# EAGLE schematic axiom_beta_plugin_module_TE0714_SDI_v0.4.123d784f (EAGLE 7.7.0)
Assembly variants: Beta

## Sheet 1 of 5
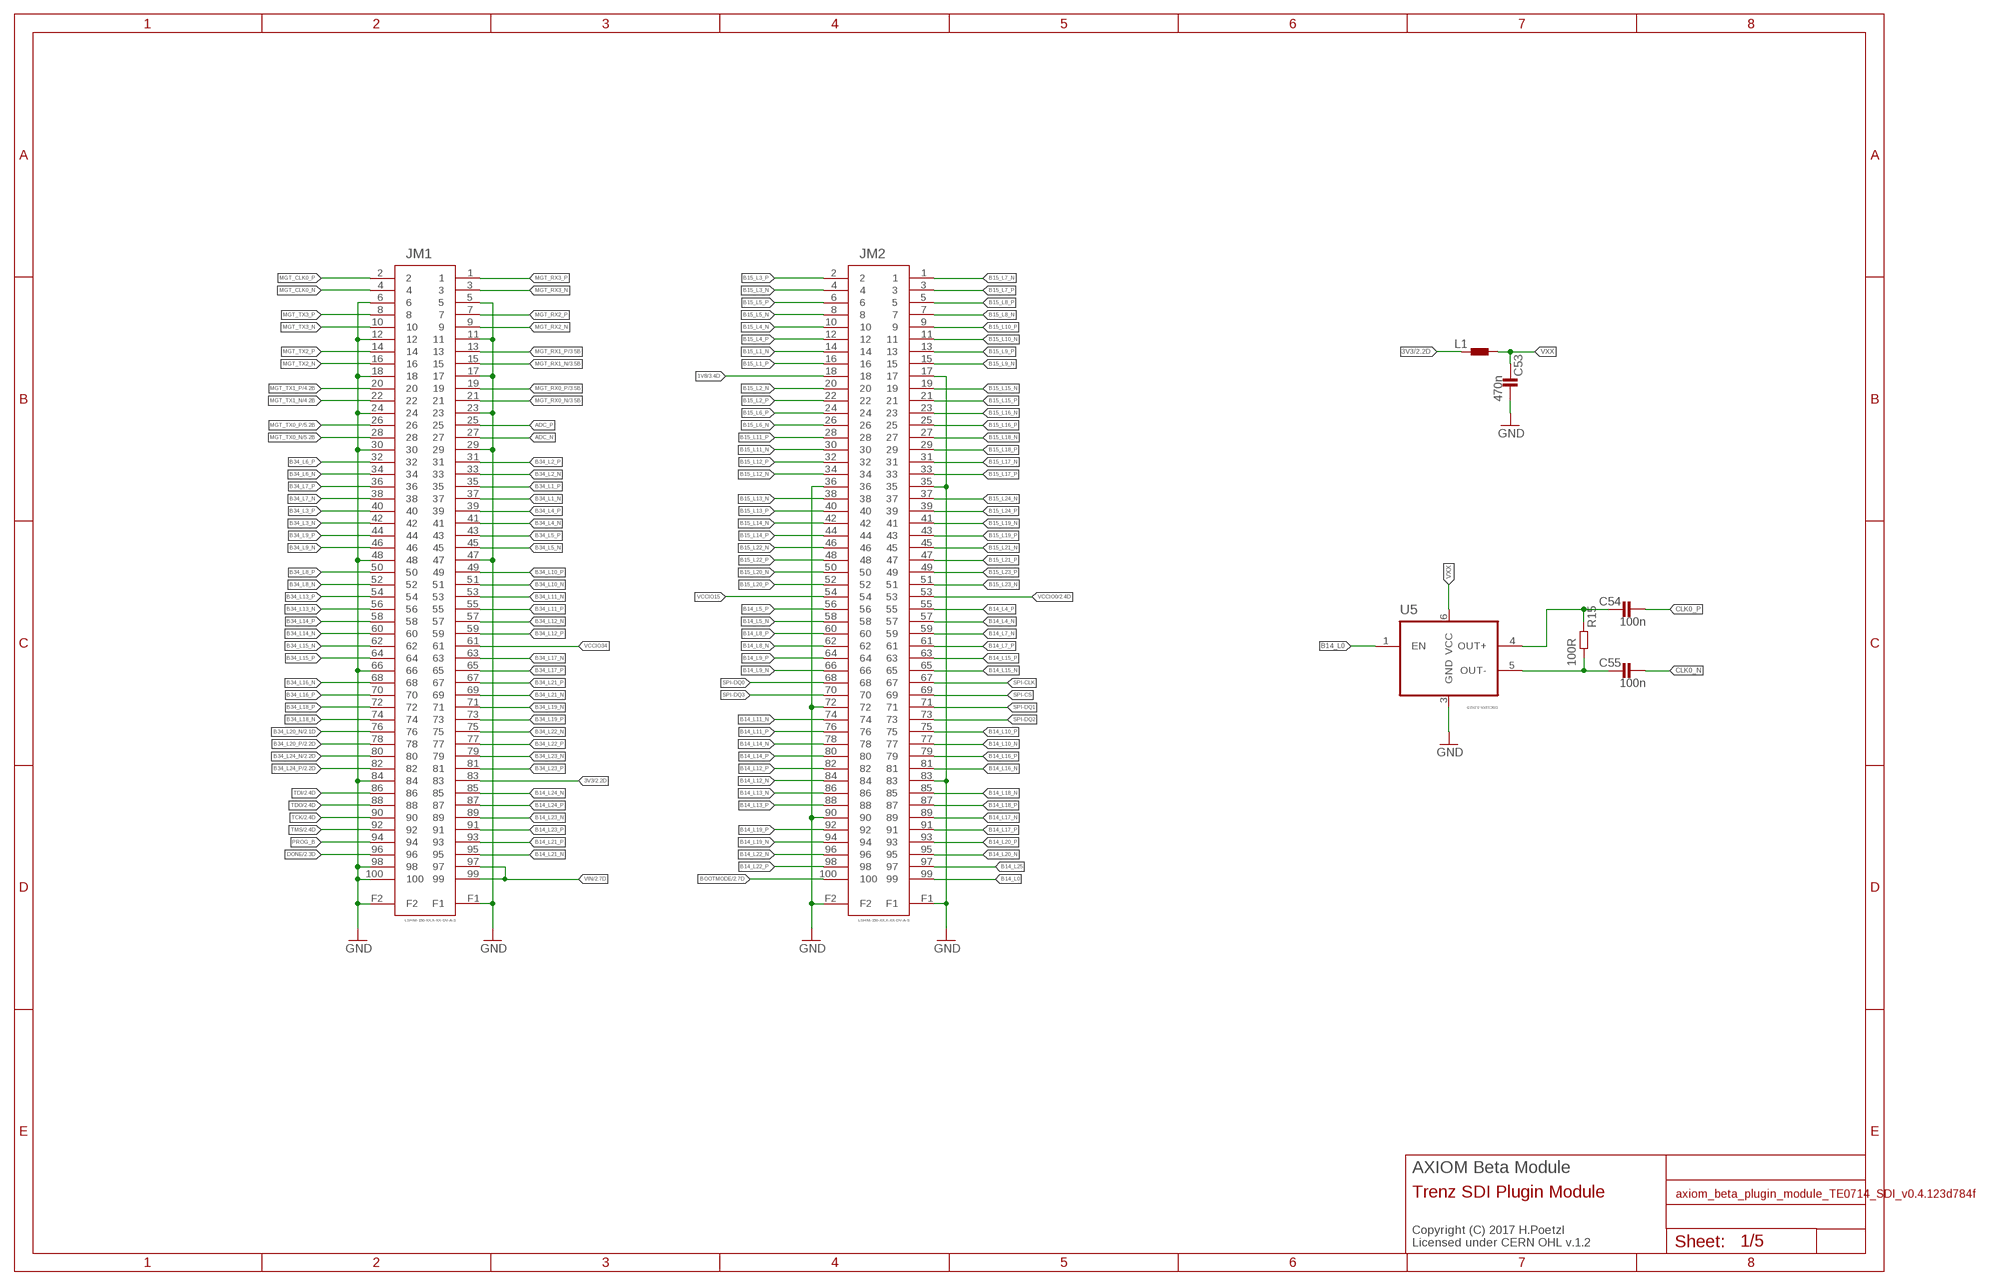
[diagram p0: schematic, sheet 1]

### Parts
C53  470n  C0402-C  [0402-C]
C54  100n  C0201-C  [0201-C]
C55  100n  C0201-C  [0201-C]
JM1  LSHM-150-XX.X-XX-DV-A-S  [LSHM-150-XX.X-XX-DV-A-S]
JM2  LSHM-150-XX.X-XX-DV-A-S  [LSHM-150-XX.X-XX-DV-A-S]
L1  L0402-C  [0402-C]
R15  100R  R0201-C  [0201-C]
U5  DSC11XX-3.2X2.5  [3.2X2.5]

### Nets
1V8 [LVDS]: JM2.18 ; also sheet 3,4,5
3V3 [LVDS]: JM1.83 L1.1 ; also sheet 2,4,5
ADC_N: JM1.27
ADC_P: JM1.25
B14_L0: JM2.99 U5.1(EN)
B14_L4_N: JM2.57
B14_L4_P: JM2.55
B14_L5_N: JM2.58
B14_L5_P: JM2.56
B14_L7_N: JM2.59
B14_L7_P: JM2.61
B14_L8_N: JM2.62
B14_L8_P: JM2.60
B14_L9_N: JM2.66
B14_L9_P: JM2.64
B14_L10_N: JM2.77
B14_L10_P: JM2.75
B14_L11_N: JM2.74
B14_L11_P: JM2.76
B14_L12_N: JM2.84
B14_L12_P: JM2.82
B14_L13_N: JM2.86
B14_L13_P: JM2.88
B14_L14_N: JM2.78
B14_L14_P: JM2.80
B14_L15_N: JM2.65
B14_L15_P: JM2.63
B14_L16_N: JM2.81
B14_L16_P: JM2.79
B14_L17_N: JM2.89
B14_L17_P: JM2.91
B14_L18_N: JM2.85
B14_L18_P: JM2.87
B14_L19_N: JM2.94
B14_L19_P: JM2.92
B14_L20_N: JM2.95
B14_L20_P: JM2.93
B14_L21_N: JM1.95
B14_L21_P: JM1.93
B14_L22_N: JM2.96
B14_L22_P: JM2.98
B14_L23_N: JM1.89
B14_L23_P: JM1.91
B14_L24_N: JM1.85
B14_L24_P: JM1.87
B14_L25: JM2.97
B15_L1_N: JM2.14
B15_L1_P: JM2.16
B15_L2_N: JM2.20
B15_L2_P: JM2.22
B15_L3_N: JM2.4
B15_L3_P: JM2.2
B15_L4_N: JM2.10
B15_L4_P: JM2.12
B15_L5_N: JM2.8
B15_L5_P: JM2.6
B15_L6_N: JM2.26
B15_L6_P: JM2.24
B15_L7_N: JM2.1
B15_L7_P: JM2.3
B15_L8_N: JM2.7
B15_L8_P: JM2.5
B15_L9_N: JM2.15
B15_L9_P: JM2.13
B15_L10_N: JM2.11
B15_L10_P: JM2.9
B15_L11_N: JM2.30
B15_L11_P: JM2.28
B15_L12_N: JM2.34
B15_L12_P: JM2.32
B15_L13_N: JM2.38
B15_L13_P: JM2.40
B15_L14_N: JM2.42
B15_L14_P: JM2.44
B15_L15_N: JM2.19
B15_L15_P: JM2.21
B15_L16_N: JM2.23
B15_L16_P: JM2.25
B15_L17_N: JM2.31
B15_L17_P: JM2.33
B15_L18_N: JM2.27
B15_L18_P: JM2.29
B15_L19_N: JM2.41
B15_L19_P: JM2.43
B15_L20_N: JM2.50
B15_L20_P: JM2.52
B15_L21_N: JM2.45
B15_L21_P: JM2.47
B15_L22_N: JM2.46
B15_L22_P: JM2.48
B15_L23_N: JM2.51
B15_L23_P: JM2.49
B15_L24_N: JM2.37
B15_L24_P: JM2.39
B34_L1_N: JM1.37
B34_L1_P: JM1.35
B34_L2_N: JM1.33
B34_L2_P: JM1.31
B34_L3_N: JM1.42
B34_L3_P: JM1.40
B34_L4_N: JM1.41
B34_L4_P: JM1.39
B34_L5_N: JM1.45
B34_L5_P: JM1.43
B34_L6_N: JM1.34
B34_L6_P: JM1.32
B34_L7_N: JM1.38
B34_L7_P: JM1.36
B34_L8_N: JM1.52
B34_L8_P: JM1.50
B34_L9_N: JM1.46
B34_L9_P: JM1.44
B34_L10_N: JM1.51
B34_L10_P: JM1.49
B34_L11_N: JM1.53
B34_L11_P: JM1.55
B34_L12_N: JM1.57
B34_L12_P: JM1.59
B34_L13_N: JM1.56
B34_L13_P: JM1.54
B34_L14_N: JM1.60
B34_L14_P: JM1.58
B34_L15_N: JM1.62
B34_L15_P: JM1.64
B34_L16_N: JM1.68
B34_L16_P: JM1.70
B34_L17_N: JM1.63
B34_L17_P: JM1.65
B34_L18_N: JM1.74
B34_L18_P: JM1.72
B34_L19_N: JM1.71
B34_L19_P: JM1.73
B34_L20_N: JM1.76 ; also sheet 2
B34_L20_P: JM1.78 ; also sheet 2
B34_L21_N: JM1.69
B34_L21_P: JM1.67
B34_L22_N: JM1.75
B34_L22_P: JM1.77
B34_L23_N: JM1.79
B34_L23_P: JM1.81
B34_L24_N: JM1.80 ; also sheet 2
B34_L24_P: JM1.82 ; also sheet 2
BOOTMODE: JM2.100 ; also sheet 2
CLK0_N: C55.2
CLK0_P: C54.2
DONE: JM1.96 ; also sheet 2
GND: C53.2 JM1.5 JM1.6 JM1.11 JM1.12 JM1.17 JM1.18 JM1.23 JM1.24 JM1.29 JM1.30 JM1.47 JM1.48 JM1.66 JM1.84 JM1.98 JM1.100 JM1.F1 JM1.F2 JM2.17 JM2.35 JM2.36 JM2.72 JM2.83 JM2.90 JM2.F1 JM2.F2 U5.3(GND) ; also sheet 2,3,4,5
MGT_CLK0_N [MGT]: JM1.4
MGT_CLK0_P [MGT]: JM1.2
MGT_RX0_N [MGT]: JM1.21 ; also sheet 3
MGT_RX0_P [MGT]: JM1.19 ; also sheet 3
MGT_RX1_N [MGT]: JM1.15 ; also sheet 3
MGT_RX1_P [MGT]: JM1.13 ; also sheet 3
MGT_RX2_N [MGT]: JM1.9
MGT_RX2_P [MGT]: JM1.7
MGT_RX3_N [MGT]: JM1.3
MGT_RX3_P [MGT]: JM1.1
MGT_TX0_N [MGT]: JM1.28 ; also sheet 5
MGT_TX0_P [MGT]: JM1.26 ; also sheet 5
MGT_TX1_N [MGT]: JM1.22 ; also sheet 4
MGT_TX1_P [MGT]: JM1.20 ; also sheet 4
MGT_TX2_N [MGT]: JM1.16
MGT_TX2_P [MGT]: JM1.14
MGT_TX3_N [MGT]: JM1.10
MGT_TX3_P [MGT]: JM1.8
OUT_N: C55.1 R15.2 U5.5(OUT-)
OUT_P: C54.1 R15.1 U5.4(OUT+)
PROG_B: JM1.94
SPI-CLK: JM2.67
SPI-CS: JM2.69
SPI-DQ0: JM2.68
SPI-DQ1: JM2.71
SPI-DQ2: JM2.73
SPI-DQ3: JM2.70
TCK: JM1.90 ; also sheet 2
TDI: JM1.86 ; also sheet 2
TDO: JM1.88 ; also sheet 2
TMS: JM1.92 ; also sheet 2
VCCIO0 [LVDS]: JM2.53 ; also sheet 2
VCCIO15 [LVDS]: JM2.54
VCCIO34: JM1.61
VIN [LVDS]: JM1.97 JM1.99 ; also sheet 2
VXX: C53.1 L1.2 U5.6(VCC)

### Notes on the sheet
- AXIOM Beta Module
- Trenz SDI Plugin Module
- Copyright (C) 2017 H.Poetzl
  Licensed under CERN OHL v.1.2

## Sheet 2 of 5
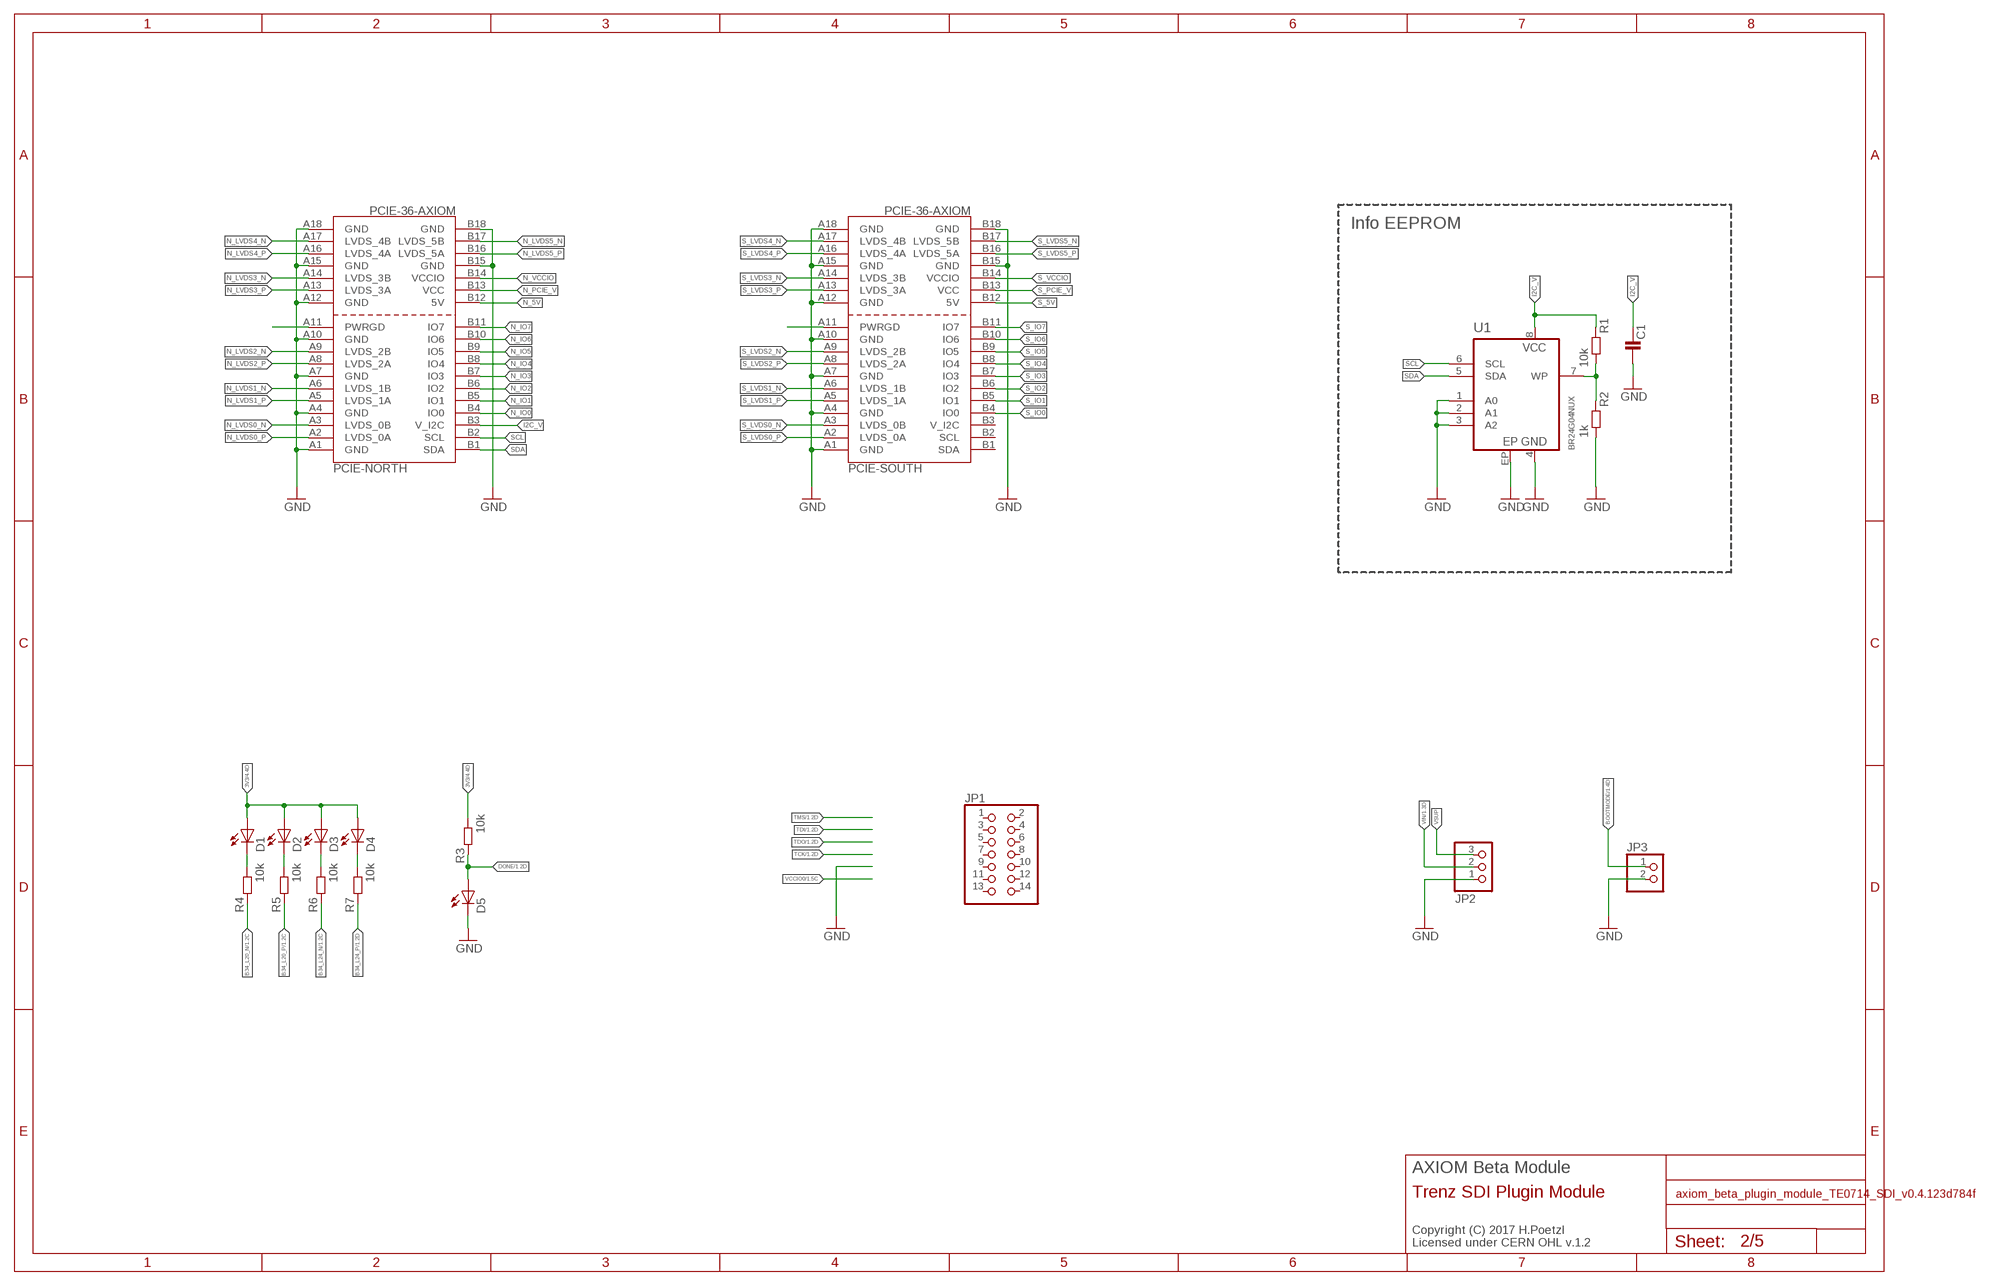
[diagram p1: schematic, sheet 2]

### Parts
C1  C0402-B  [0402-B]
D1  LED  [SMARTLED-TTW]
D2  LED  [SMARTLED-TTW]
D3  LED  [SMARTLED-TTW]
D4  LED  [SMARTLED-TTW]
D5  LED  [SMARTLED-TTW]
JP1  PINHD-2X07_2.00  [2X07M]
JP2  PINHD-1X03_2.54-90°-S  [1X03/90-S]
JP3  PINHD-1X02_2.54-S  [1X02-S]
PCIE-NORTH  PCIE-36-AXIOM  [PCIE-36-AXIOM]  (not fitted in variant Beta)
PCIE-SOUTH  PCIE-36-AXIOM  [PCIE-36-AXIOM]  (not fitted in variant Beta)
R1  10k  R0402-B  [0402-B]
R2  1k  R0402-B  [0402-B]
R3  10k  R0402-C  [0402-C]
R4  10k  R0402-C  [0402-C]
R5  10k  R0402-C  [0402-C]
R6  10k  R0402-C  [0402-C]
R7  10k  R0402-C  [0402-C]
U1  BR24G04NUX  [DFN200X300X100-9N]

### Nets
3V3 [LVDS]: D1.A@1(A) D2.A@1(A) D3.A@1(A) D4.A@1(A) R3.2 ; also sheet 1,4,5
B34_L20_N: R4.1 ; also sheet 1
B34_L20_P: R5.1 ; also sheet 1
B34_L24_N: R6.1 ; also sheet 1
B34_L24_P: R7.1 ; also sheet 1
BOOTMODE: JP3.1 ; also sheet 1
DONE: D5.A@1(A) R3.1 ; also sheet 1
GND: C1.2 D5.C@1(C) JP2.1 JP3.2 PCIE-NORTH.A1(GND) PCIE-NORTH.A4(GND) PCIE-NORTH.A7(GND) PCIE-NORTH.A10(GND) PCIE-NORTH.A12(GND) PCIE-NORTH.A15(GND) PCIE-NORTH.A18(GND) PCIE-NORTH.B15(GND) PCIE-NORTH.B18(GND) PCIE-SOUTH.A1(GND) PCIE-SOUTH.A4(GND) PCIE-SOUTH.A7(GND) PCIE-SOUTH.A10(GND) PCIE-SOUTH.A12(GND) PCIE-SOUTH.A15(GND) PCIE-SOUTH.A18(GND) PCIE-SOUTH.B15(GND) PCIE-SOUTH.B18(GND) R2.2 U1.1(A0) U1.2(A1) U1.3(A2) U1.4(GND) U1.EP ; also sheet 1,3,4,5
I2C_V: C1.1 PCIE-NORTH.B3(V_I2C) R1.1 U1.8(VCC)
N$1 [LVDS]: D1.C@1(C) R4.2
N$2 [LVDS]: D2.C@1(C) R5.2
N$3 [LVDS]: D3.C@1(C) R6.2
N$4 [LVDS]: D4.C@1(C) R7.2
N$209: PCIE-NORTH.A11(PWRGD)
N$216: R1.2 R2.1 U1.7(WP)
N$256: PCIE-SOUTH.A11(PWRGD)
N_5V: PCIE-NORTH.B12(5V)
N_IO0: PCIE-NORTH.B4(IO0)
N_IO1: PCIE-NORTH.B5(IO1)
N_IO2: PCIE-NORTH.B6(IO2)
N_IO3: PCIE-NORTH.B7(IO3)
N_IO4 [LVDS]: PCIE-NORTH.B8(IO4)
N_IO5 [LVDS]: PCIE-NORTH.B9(IO5)
N_IO6: PCIE-NORTH.B10(IO6)
N_IO7: PCIE-NORTH.B11(IO7)
N_LVDS0_N: PCIE-NORTH.A3(LVDS_0B)
N_LVDS0_P: PCIE-NORTH.A2(LVDS_0A)
N_LVDS1_N: PCIE-NORTH.A6(LVDS_1B)
N_LVDS1_P: PCIE-NORTH.A5(LVDS_1A)
N_LVDS2_N: PCIE-NORTH.A9(LVDS_2B)
N_LVDS2_P: PCIE-NORTH.A8(LVDS_2A)
N_LVDS3_N: PCIE-NORTH.A14(LVDS_3B)
N_LVDS3_P: PCIE-NORTH.A13(LVDS_3A)
N_LVDS4_N: PCIE-NORTH.A17(LVDS_4B)
N_LVDS4_P: PCIE-NORTH.A16(LVDS_4A)
N_LVDS5_N: PCIE-NORTH.B17(LVDS_5B)
N_LVDS5_P: PCIE-NORTH.B16(LVDS_5A)
N_PCIE_V: PCIE-NORTH.B13(VCC)
N_VCCIO: PCIE-NORTH.B14(VCCIO)
S_5V: PCIE-SOUTH.B12(5V)
S_IO0: PCIE-SOUTH.B4(IO0)
S_IO1: PCIE-SOUTH.B5(IO1)
S_IO2 [LVDS]: PCIE-SOUTH.B6(IO2)
S_IO3: PCIE-SOUTH.B7(IO3)
S_IO4: PCIE-SOUTH.B8(IO4)
S_IO5: PCIE-SOUTH.B9(IO5)
S_IO6: PCIE-SOUTH.B10(IO6)
S_IO7 [LVDS]: PCIE-SOUTH.B11(IO7)
S_LVDS0_N: PCIE-SOUTH.A3(LVDS_0B)
S_LVDS0_P: PCIE-SOUTH.A2(LVDS_0A)
S_LVDS1_N: PCIE-SOUTH.A6(LVDS_1B)
S_LVDS1_P: PCIE-SOUTH.A5(LVDS_1A)
S_LVDS2_N: PCIE-SOUTH.A9(LVDS_2B)
S_LVDS2_P: PCIE-SOUTH.A8(LVDS_2A)
S_LVDS3_N: PCIE-SOUTH.A14(LVDS_3B)
S_LVDS3_P: PCIE-SOUTH.A13(LVDS_3A)
S_LVDS4_N: PCIE-SOUTH.A17(LVDS_4B)
S_LVDS4_P: PCIE-SOUTH.A16(LVDS_4A)
S_LVDS5_N: PCIE-SOUTH.B17(LVDS_5B)
S_LVDS5_P: PCIE-SOUTH.B16(LVDS_5A)
S_PCIE_V: PCIE-SOUTH.B13(VCC)
S_VCCIO: PCIE-SOUTH.B14(VCCIO)
SCL: PCIE-NORTH.B2(SCL) U1.6(SCL)
SDA: PCIE-NORTH.B1(SDA) U1.5(SDA)
VIN [LVDS]: JP2.2 ; also sheet 1
VSUP: JP2.3
Unconnected: JP1.1 JP1.2 JP1.3 JP1.4 JP1.5 JP1.6 JP1.7 JP1.8 JP1.9 JP1.10 JP1.11 JP1.12 JP1.13 JP1.14 PCIE-SOUTH.B1(SDA) PCIE-SOUTH.B2(SCL) PCIE-SOUTH.B3(V_I2C)

### Notes on the sheet
- Info EEPROM
- AXIOM Beta Module
- Trenz SDI Plugin Module
- Copyright (C) 2017 H.Poetzl
  Licensed under CERN OHL v.1.2

## Sheet 3 of 5
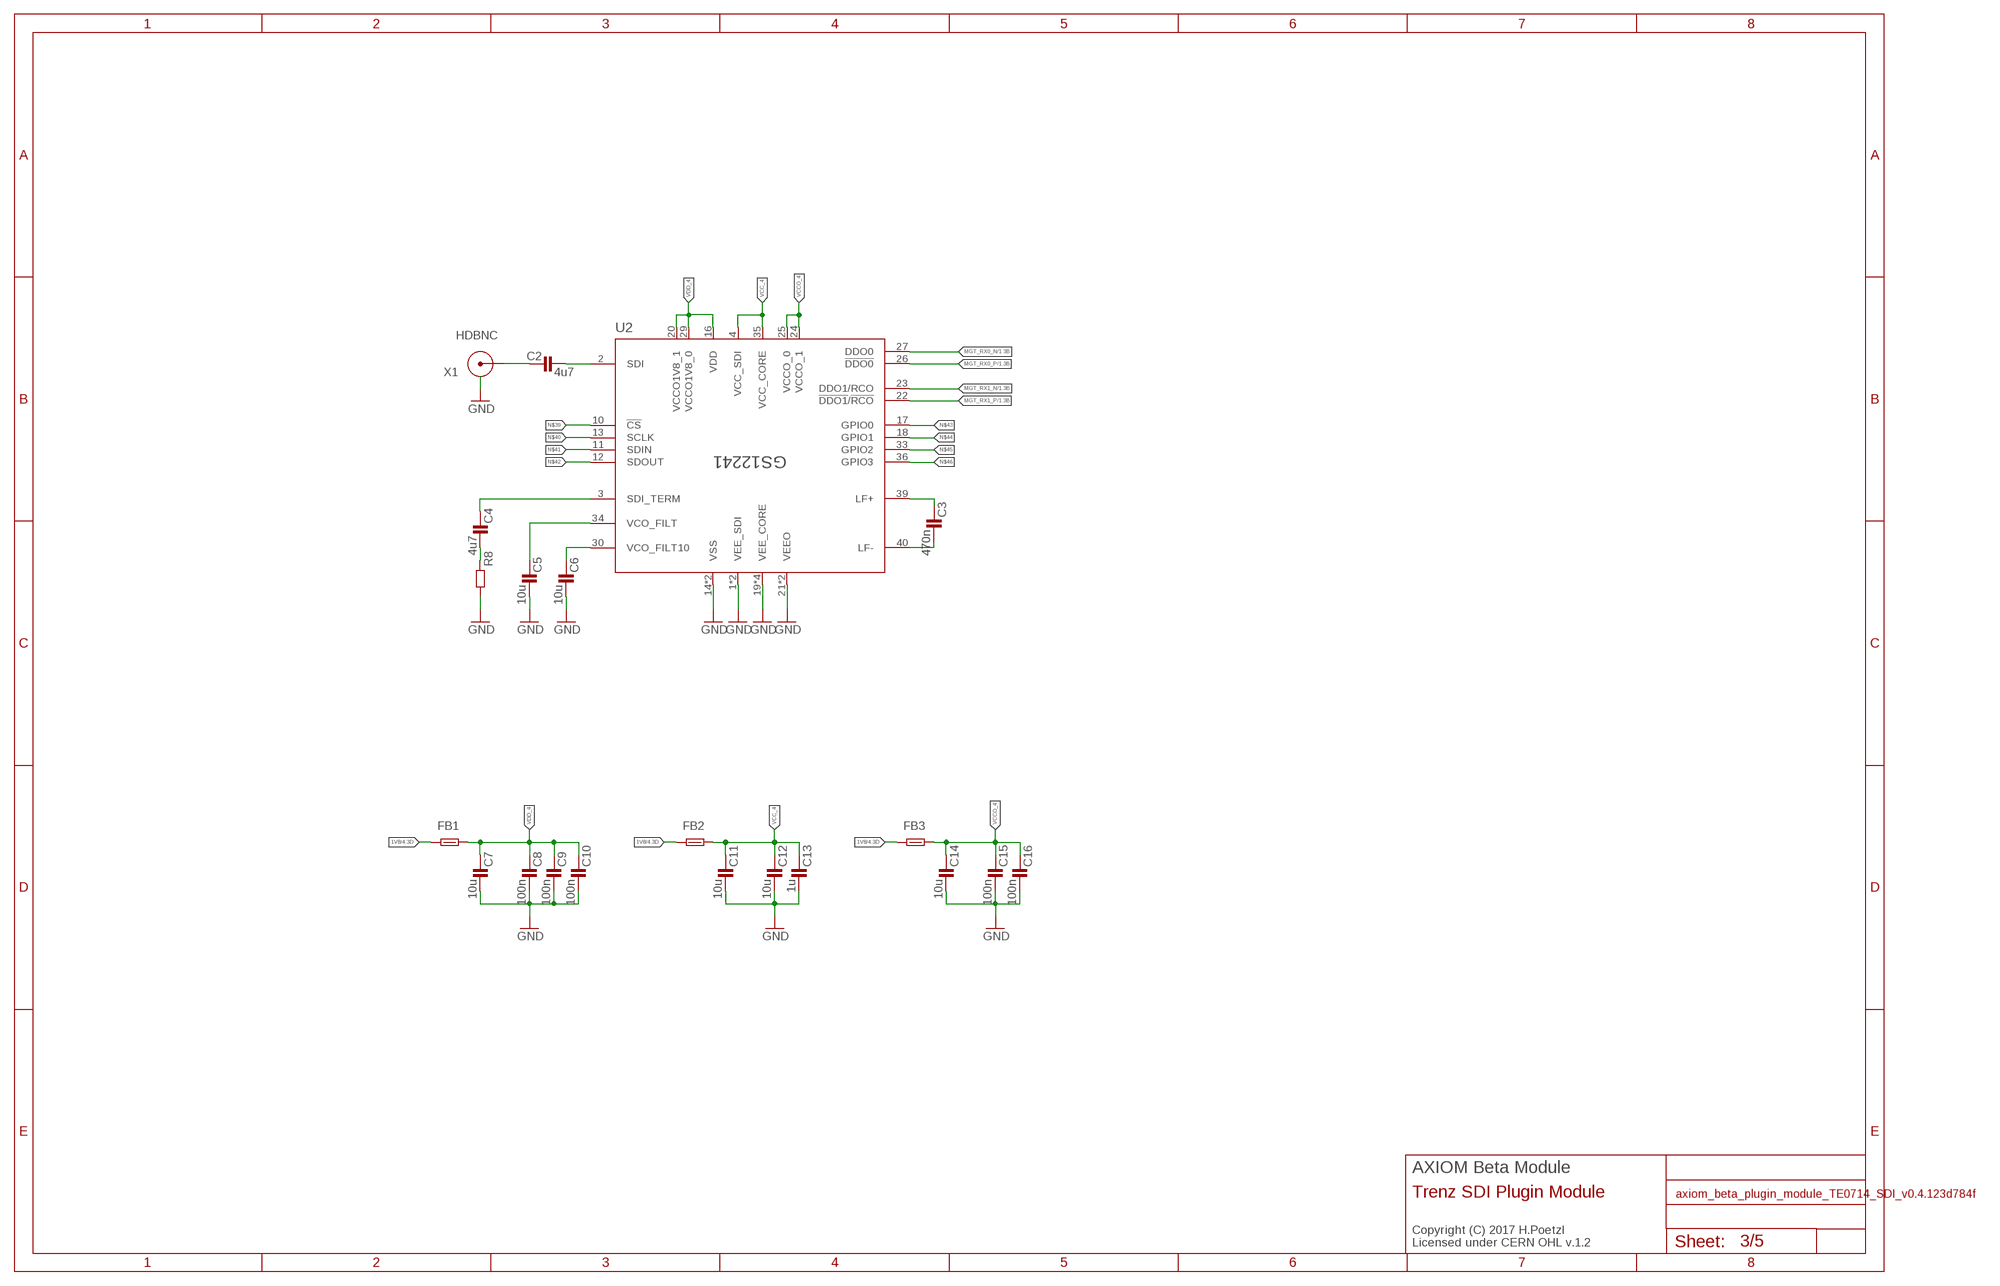
[diagram p2: schematic, sheet 3]

### Parts
C2  4u7  C0402-C  [0402-C]
C3  470n  C0201-C  [0201-C]
C4  4u7  C0201-C  [0201-C]
C5  10u  C0201-C  [0201-C]
C6  10u  C0201-C  [0201-C]
C7  10u  C0402-C  [0402-C]
C8  100n  C0201-C  [0201-C]
C9  100n  C0201-C  [0201-C]
C10  100n  C0201-C  [0201-C]
C11  10u  C0402-C  [0402-C]
C12  10u  C0201-C  [0201-C]
C13  1u  C0201-C  [0201-C]
C14  10u  C0402-C  [0402-C]
C15  100n  C0201-C  [0201-C]
C16  100n  C0201-C  [0201-C]
FB1  FB0402-C  [0402-C]
FB2  FB0402-C  [0402-C]
FB3  FB0402-C  [0402-C]
R8  R0201-C  [0201-C]
U2  GS12241  [UQFN40P600X400X100-41N]
X1  HDBNC  [HDBNC_EDGE_2SIDE]

### Nets
1V8 [LVDS]: FB1.1 FB2.1 FB3.1 ; also sheet 1,4,5
GND: C5.2 C6.2 C7.2 C8.2 C9.2 C10.2 C11.2 C12.2 C13.2 C14.2 C15.2 C16.2 R8.2 U2.1(VEE_SDI) U2.8(VEE_SDI) U2.14(VSS) U2.15(VSS) U2.19(VEE_CORE) U2.21(VEEO) U2.28(VEEO) U2.31(VEE_CORE) U2.37(VEE_CORE) U2.38(VEE_CORE) X1.2@1(GND) X1.2@2(GND) X1.2@3(GND) ; also sheet 1,2,4,5
MGT_RX0_N [MGT]: U2.27(DDO0) ; also sheet 1
MGT_RX0_P [MGT]: U2.26(!DDO0) ; also sheet 1
MGT_RX1_N [MGT]: U2.23(DDO1/RCO) ; also sheet 1
MGT_RX1_P [MGT]: U2.22(!DDO1!/!RCO) ; also sheet 1
N$7: C3.2 U2.40(LF-)
N$8: C3.1 U2.39(LF+)
N$11: C6.1 U2.30(VCO_FILT10)
N$12: C5.1 U2.34(VCO_FILT)
N$19: C4.2 R8.1
N$20: C4.1 U2.3(SDI_TERM)
N$37 [75Ohm]: C2.2 U2.2(SDI)
N$38: C2.1 X1.1
N$39: U2.10(!CS)
N$40: U2.13(SCLK)
N$41: U2.11(SDIN)
N$42: U2.12(SDOUT)
N$43: U2.17(GPIO0)
N$44: U2.18(GPIO1)
N$45: U2.33(GPIO2)
N$46: U2.36(GPIO3)
VCC_4: C11.1 C12.1 C13.1 FB2.2 U2.4(VCC_SDI) U2.35(VCC_CORE)
VCCO_4: C14.1 C15.1 C16.1 FB3.2 U2.24(VCCO_1) U2.25(VCCO_0)
VDD_4: C7.1 C8.1 C9.1 C10.1 FB1.2 U2.16(VDD) U2.20(VCCO1V8_1) U2.29(VCCO1V8_0)

### Notes on the sheet
- AXIOM Beta Module
- Trenz SDI Plugin Module
- Copyright (C) 2017 H.Poetzl
  Licensed under CERN OHL v.1.2

## Sheet 4 of 5
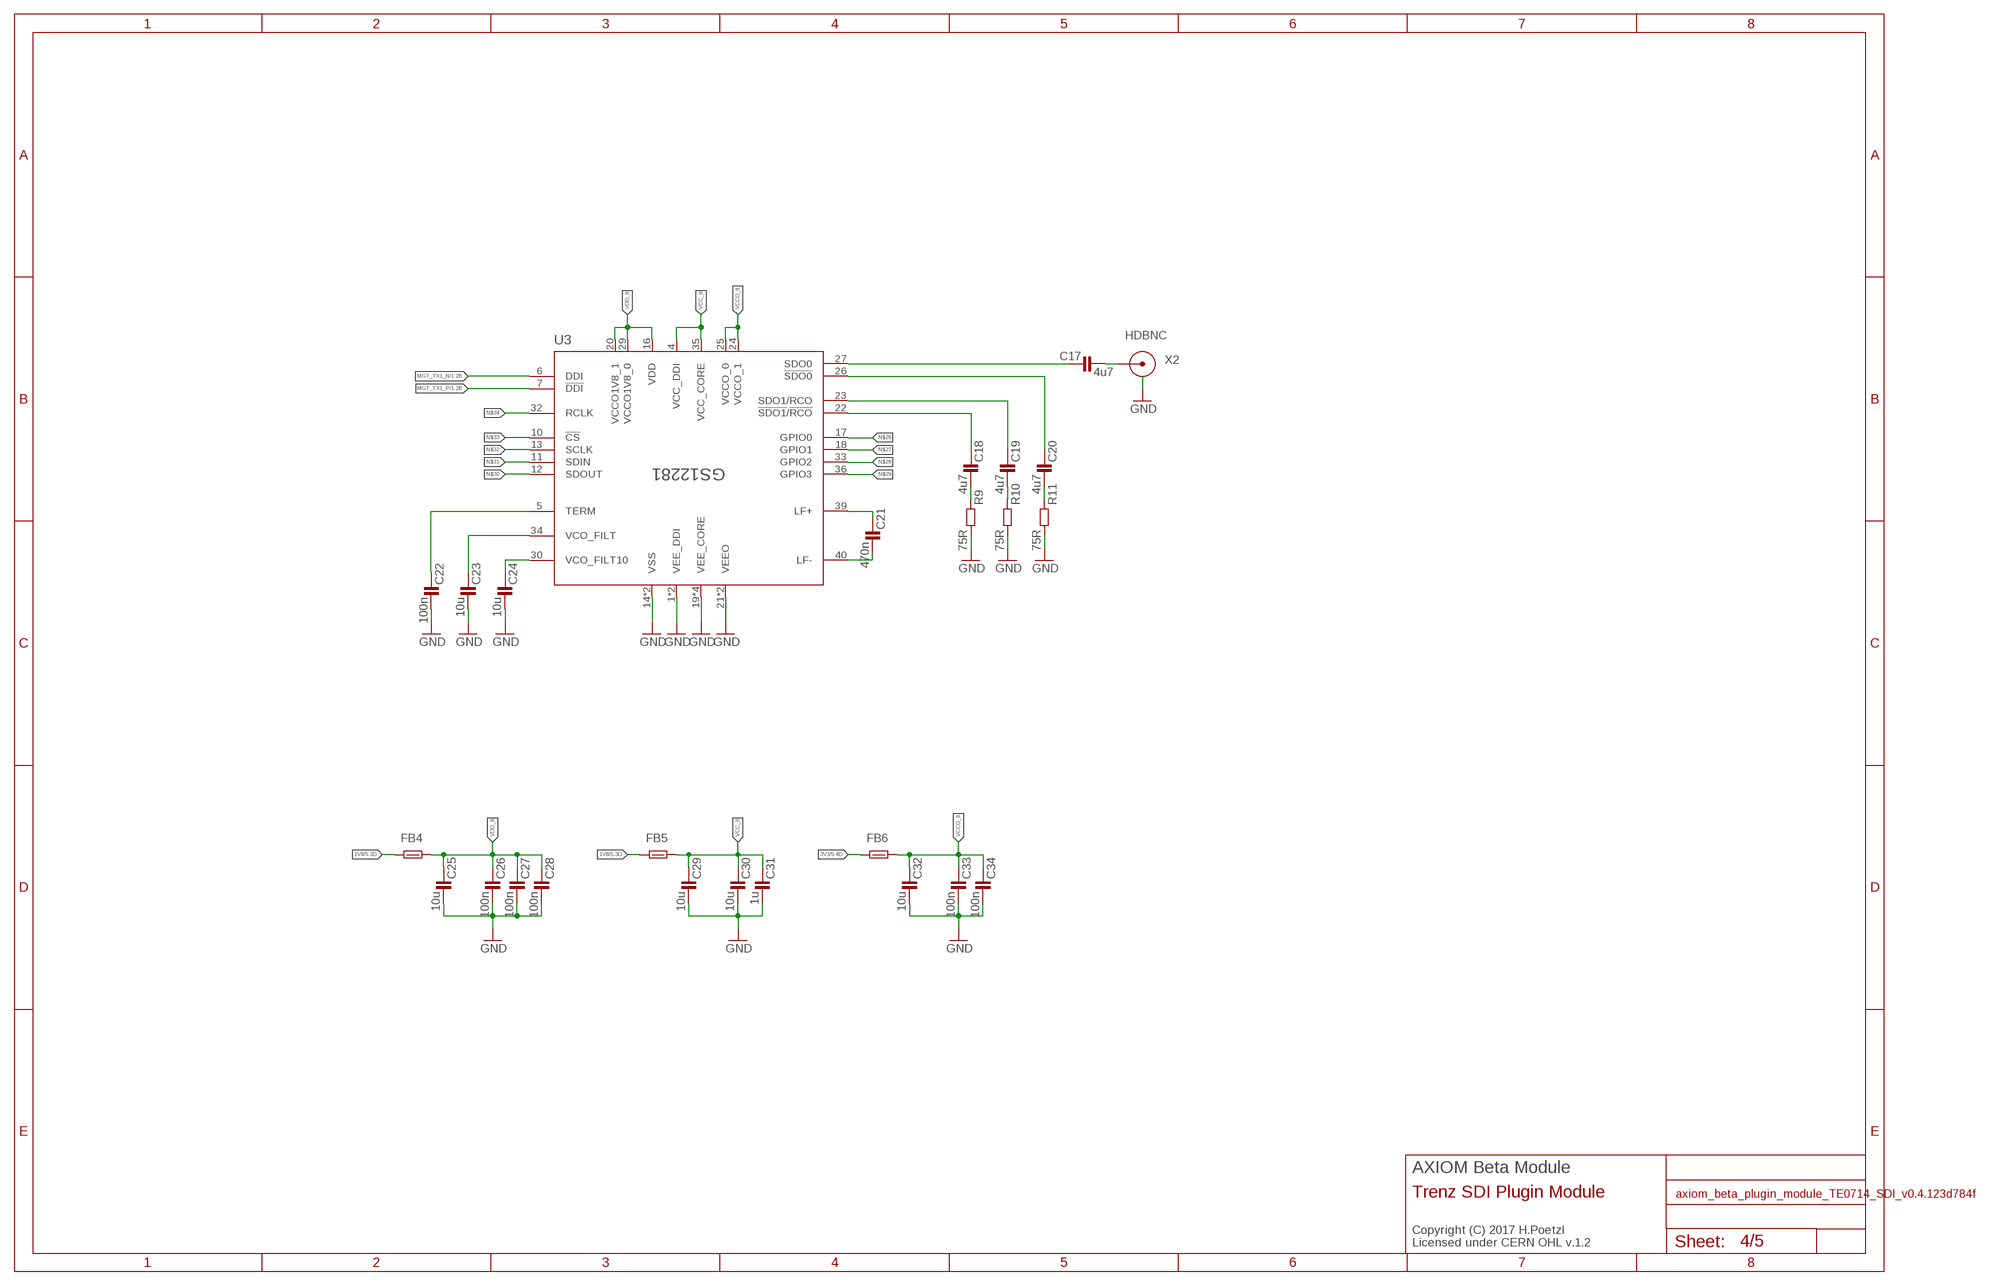
[diagram p3: schematic, sheet 4]

### Parts
C17  4u7  C0402-C  [0402-C]
C18  4u7  C0201-C  [0201-C]
C19  4u7  C0201-C  [0201-C]
C20  4u7  C0201-C  [0201-C]
C21  470n  C0201-C  [0201-C]
C22  100n  C0201-C  [0201-C]
C23  10u  C0201-C  [0201-C]
C24  10u  C0201-C  [0201-C]
C25  10u  C0402-C  [0402-C]
C26  100n  C0201-C  [0201-C]
C27  100n  C0201-C  [0201-C]
C28  100n  C0201-C  [0201-C]
C29  10u  C0402-C  [0402-C]
C30  10u  C0201-C  [0201-C]
C31  1u  C0201-C  [0201-C]
C32  10u  C0402-C  [0402-C]
C33  100n  C0201-C  [0201-C]
C34  100n  C0201-C  [0201-C]
FB4  FB0402-C  [0402-C]
FB5  FB0402-C  [0402-C]
FB6  FB0402-C  [0402-C]
R9  75R  R0201-C  [0201-C]
R10  75R  R0201-C  [0201-C]
R11  75R  R0201-C  [0201-C]
U3  GS12281  [UQFN40P600X400X100-41N]
X2  HDBNC  [HDBNC_EDGE_2SIDE]

### Nets
1V8 [LVDS]: FB4.1 FB5.1 ; also sheet 1,3,5
3V3 [LVDS]: FB6.1 ; also sheet 1,2,5
GND: C22.2 C23.2 C24.2 C25.2 C26.2 C27.2 C28.2 C29.2 C30.2 C31.2 C32.2 C33.2 C34.2 R9.2 R10.2 R11.2 U3.1(VEE_DDI) U3.8(VEE_DDI) U3.14(VSS) U3.15(VSS) U3.19(VEE_CORE) U3.21(VEEO) U3.28(VEEO) U3.31(VEE_CORE) U3.37(VEE_CORE) U3.38(VEE_CORE) X2.2@1(GND) X2.2@2(GND) X2.2@3(GND) ; also sheet 1,2,3,5
MGT_TX1_N [MGT]: U3.6(DDI) ; also sheet 1
MGT_TX1_P [MGT]: U3.7(!DDI) ; also sheet 1
N$9: C21.2 U3.40(LF-)
N$10: C21.1 U3.39(LF+)
N$13: C18.2 R9.1
N$14: C18.1 U3.22(!SDO1!/!RCO)
N$15 [75Ohm]: C19.1 U3.23(SDO1/RCO)
N$16: C19.2 R10.1
N$17: C20.1 U3.26(!SDO0)
N$18: C20.2 R11.1
N$21: C24.1 U3.30(VCO_FILT10)
N$22: C23.1 U3.34(VCO_FILT)
N$23 [75Ohm]: C17.1 U3.27(SDO0)
N$24: C22.1 U3.5(TERM)
N$25: C17.2 X2.1
N$26: U3.17(GPIO0)
N$27: U3.18(GPIO1)
N$28: U3.33(GPIO2)
N$29: U3.36(GPIO3)
N$30: U3.12(SDOUT)
N$31: U3.11(SDIN)
N$32: U3.13(SCLK)
N$33: U3.10(!CS)
N$34: U3.32(RCLK)
VCC_8: C29.1 C30.1 C31.1 FB5.2 U3.4(VCC_DDI) U3.35(VCC_CORE)
VCCO_8: C32.1 C33.1 C34.1 FB6.2 U3.24(VCCO_1) U3.25(VCCO_0)
VDD_8: C25.1 C26.1 C27.1 C28.1 FB4.2 U3.16(VDD) U3.20(VCCO1V8_1) U3.29(VCCO1V8_0)

### Notes on the sheet
- AXIOM Beta Module
- Trenz SDI Plugin Module
- Copyright (C) 2017 H.Poetzl
  Licensed under CERN OHL v.1.2

## Sheet 5 of 5
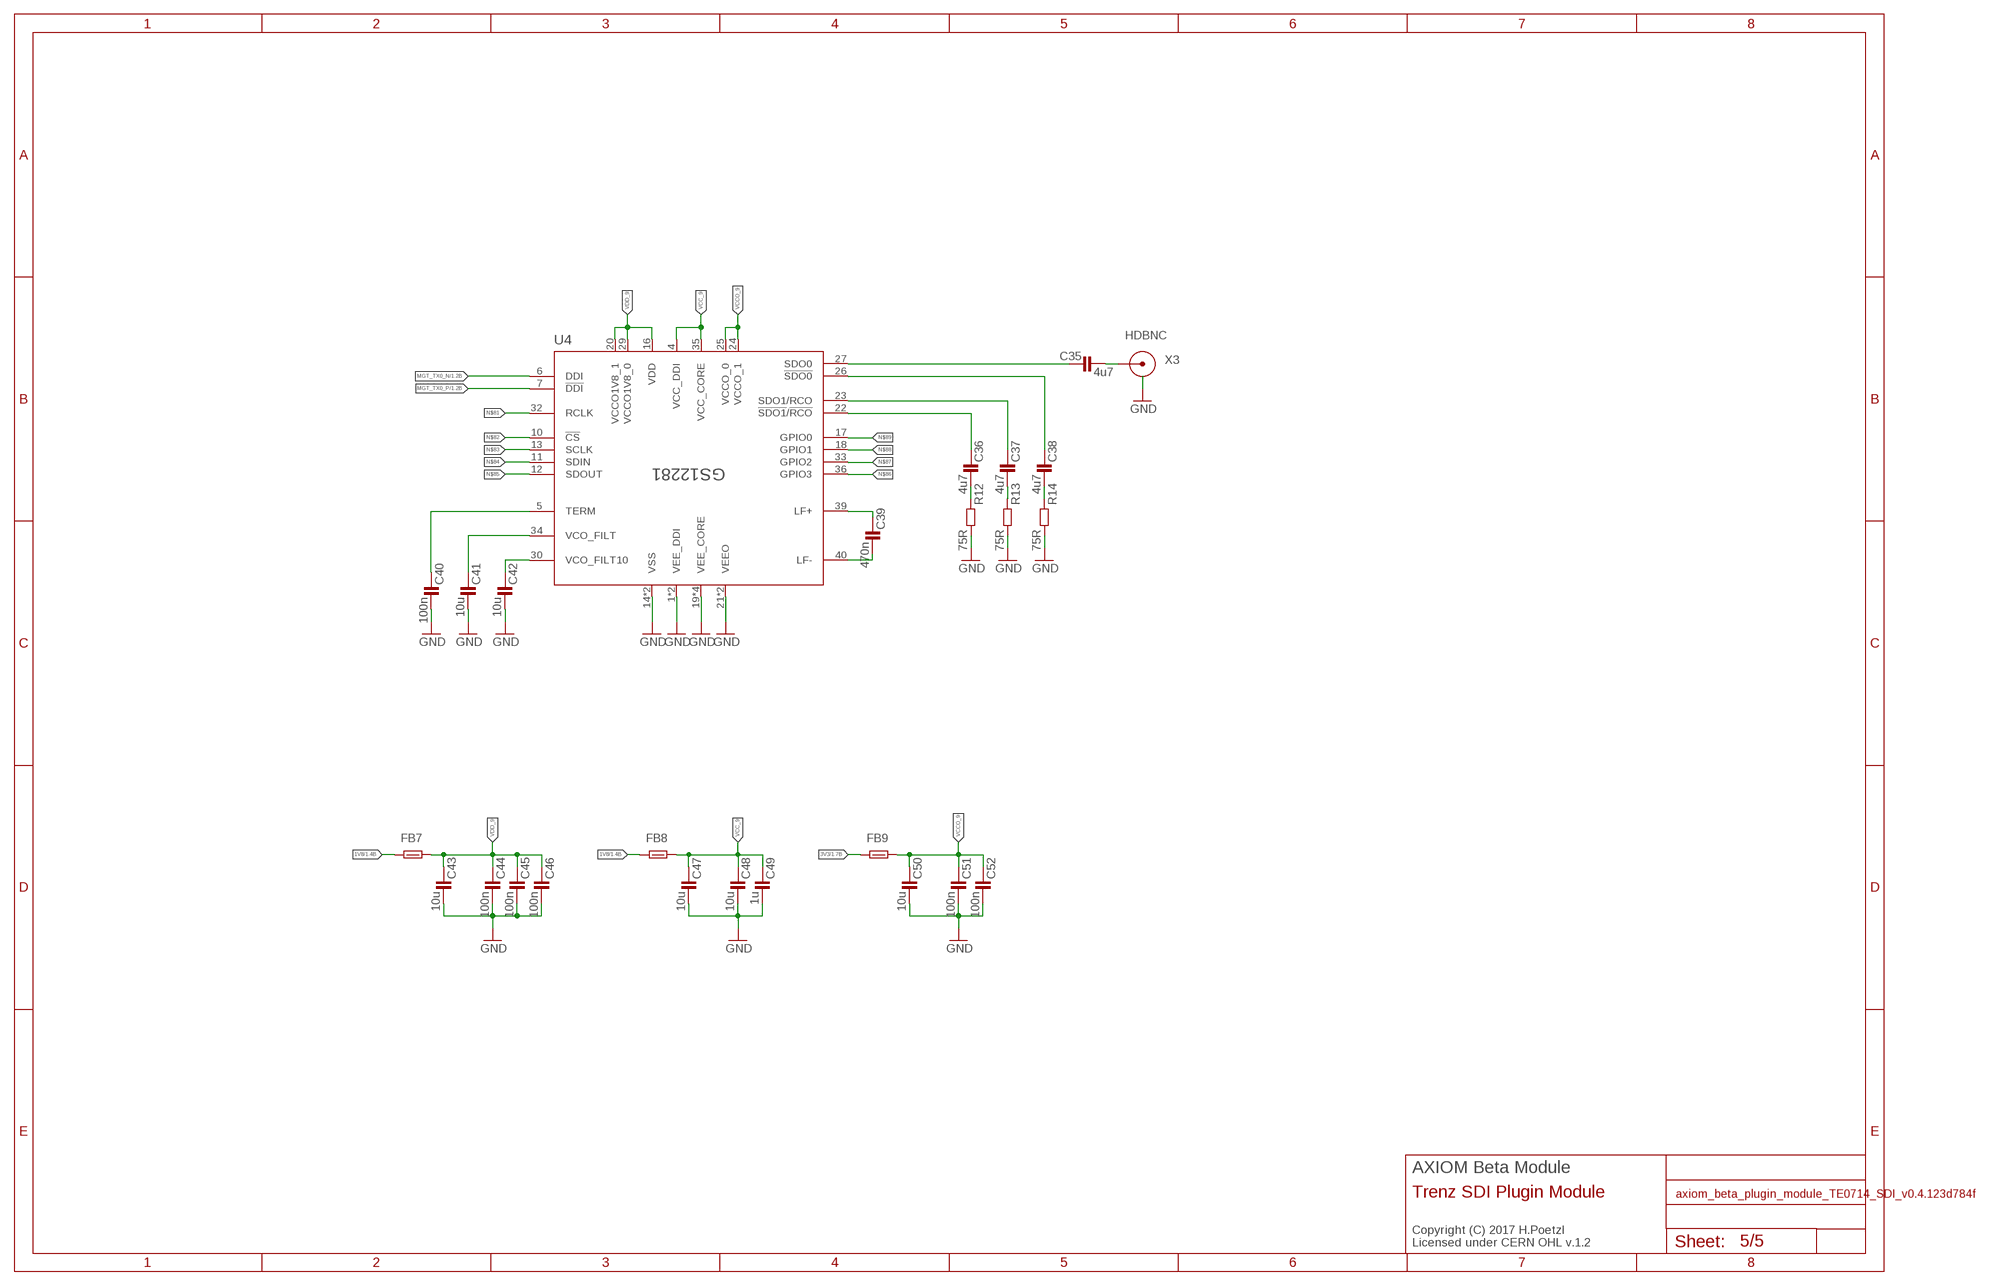
[diagram p4: schematic, sheet 5]

### Parts
C35  4u7  C0402-C  [0402-C]
C36  4u7  C0201-C  [0201-C]
C37  4u7  C0201-C  [0201-C]
C38  4u7  C0201-C  [0201-C]
C39  470n  C0201-C  [0201-C]
C40  100n  C0201-C  [0201-C]
C41  10u  C0201-C  [0201-C]
C42  10u  C0201-C  [0201-C]
C43  10u  C0402-C  [0402-C]
C44  100n  C0201-C  [0201-C]
C45  100n  C0201-C  [0201-C]
C46  100n  C0201-C  [0201-C]
C47  10u  C0402-C  [0402-C]
C48  10u  C0201-C  [0201-C]
C49  1u  C0201-C  [0201-C]
C50  10u  C0402-C  [0402-C]
C51  100n  C0201-C  [0201-C]
C52  100n  C0201-C  [0201-C]
FB7  FB0402-C  [0402-C]
FB8  FB0402-C  [0402-C]
FB9  FB0402-C  [0402-C]
R12  75R  R0201-C  [0201-C]
R13  75R  R0201-C  [0201-C]
R14  75R  R0201-C  [0201-C]
U4  GS12281  [UQFN40P600X400X100-41N]
X3  HDBNC  [HDBNC_EDGE_2SIDE]

### Nets
1V8 [LVDS]: FB7.1 FB8.1 ; also sheet 1,3,4
3V3 [LVDS]: FB9.1 ; also sheet 1,2,4
GND: C40.2 C41.2 C42.2 C43.2 C44.2 C45.2 C46.2 C47.2 C48.2 C49.2 C50.2 C51.2 C52.2 R12.2 R13.2 R14.2 U4.1(VEE_DDI) U4.8(VEE_DDI) U4.14(VSS) U4.15(VSS) U4.19(VEE_CORE) U4.21(VEEO) U4.28(VEEO) U4.31(VEE_CORE) U4.37(VEE_CORE) U4.38(VEE_CORE) X3.2@1(GND) X3.2@2(GND) X3.2@3(GND) ; also sheet 1,2,3,4
MGT_TX0_N [MGT]: U4.6(DDI) ; also sheet 1
MGT_TX0_P [MGT]: U4.7(!DDI) ; also sheet 1
N$58 [75Ohm]: C35.1 U4.27(SDO0)
N$59: C35.2 X3.1
N$78: C39.2 U4.40(LF-)
N$81: U4.32(RCLK)
N$82: U4.10(!CS)
N$83: U4.13(SCLK)
N$84: U4.11(SDIN)
N$85: U4.12(SDOUT)
N$86: U4.36(GPIO3)
N$87: U4.33(GPIO2)
N$88: U4.18(GPIO1)
N$89: U4.17(GPIO0)
N$90: C40.1 U4.5(TERM)
N$91: C41.1 U4.34(VCO_FILT)
N$92: C42.1 U4.30(VCO_FILT10)
N$93: C38.2 R14.1
N$94: C38.1 U4.26(!SDO0)
N$95: C37.2 R13.1
N$96 [75Ohm]: C37.1 U4.23(SDO1/RCO)
N$97: C36.1 U4.22(!SDO1!/!RCO)
N$98: C36.2 R12.1
N$99: C39.1 U4.39(LF+)
VCC_9: C47.1 C48.1 C49.1 FB8.2 U4.4(VCC_DDI) U4.35(VCC_CORE)
VCCO_9: C50.1 C51.1 C52.1 FB9.2 U4.24(VCCO_1) U4.25(VCCO_0)
VDD_9: C43.1 C44.1 C45.1 C46.1 FB7.2 U4.16(VDD) U4.20(VCCO1V8_1) U4.29(VCCO1V8_0)

### Notes on the sheet
- AXIOM Beta Module
- Trenz SDI Plugin Module
- Copyright (C) 2017 H.Poetzl
  Licensed under CERN OHL v.1.2

## Library data of the parts
C1-C55 = generic-rcl:C
D1-D5 = led:LED: LED OSRAM: - CHIPLED LG R971, LG N971, LY N971, LG Q971, LY Q971, LO R971, LY R971 LH N974, LH R974 LS Q976, LO Q976, LY Q976 LO Q996 - Hyper CHIPLED LW Q18S LB Q993, LB Q99A, LB R99A - SideLED LS A670, LO A670, LY A670, LG A670, LP A670 LB A673, LV A673, LT A673, LW A673 LH A674 LY A675 LS A676, LA A676, LO A676, LY A676, LW A676 LS A679, LY A679, LG A679 - Hyper Micro SIDELED® LS Y876, LA Y876, LO Y876, LY Y876 LT Y87S - SmartLED LW L88C, LW L88S LB L89C, LB L89S, LG L890 LS L89K, LO L89K, LY L89K LS L896, LA L896, LO L896, LY L896 - TOPLED LS T670, LO T670, LY T670, LG T670, LP T670 LSG T670, LSP T670, LSY T670, LOP T670, LYG T670 LG T671, LOG T671, LSG T671 LB T673, LV T673, LT T673, LW T673 LH T674 LS T676, LA T676, LO T676, LY T676, LB T676, LH T676, LSB T676, LW T676 LB T67C, LV T67C, LT T67C, LS T67K, LO T67K, LY T67K, LW E67C LS E67B, LA E67B, LO E67B, LY E67B, LB E67C, LV E67C, LT E67C LW T67C LS T679, LY T679, LG T679 LS T770, LO T770, LY T770, LG T770, LP T770 LB T773, LV T773, LT T773, LW T773 LH T774 LS E675, LA E675, LY E675, LS T675 LS T776, LA T776, LO T776, LY T776, LB T776 LHGB T686 LT T68C, LB T68C - Hyper Mini TOPLED® LB M676 - Mini TOPLED Santana® LG M470 LS M47K, LO M47K, LY M47K Source: http://www.osram.convergy.de LUXEON: - LUMILED® LXK2-PW12-R00, LXK2-PW12-S00, LXK2-PW14-U00, LXK2-PW14-V00 LXK2-PM12-R00, LXK2-PM12-S00, LXK2-PM14-U00 LXK2-PE12-Q00, LXK2-PE12-R00, LXK2-PE12-S00, LXK2-PE14-T00, LXK2-PE14-U00 LXK2-PB12-K00, LXK2-PB12-L00, LXK2-PB12-M00, LXK2-PB14-N00, LXK2-PB14-P00, LXK2-PB14-Q00 LXK2-PR12-L00, LXK2-PR12-M00, LXK2-PR14-Q00, LXK2-PR14-R00 LXK2-PD12-Q00, LXK2-PD12-R00, LXK2-PD12-S00 LXK2-PH12-R00, LXK2-PH12-S00 LXK2-PL12-P00, LXK2-PL12-Q00, LXK2-PL12-R00 Source: www.luxeon.com KINGBRIGHT: KA-3528ASYC Source: www.kingbright.com
FB1-FB9 = generic-rcl:FB
JM1 JM2 = LSHM-150-XX.X-XX-DV-A-S:LSHM-150-XX.X-XX-DV-A-S: 0.5MM TERMINAL/SOCKET COMBO. MANUFACTURER: SAMTEC.
JP1 = pinhead-2:PINHD-2X07: PIN HEADER
JP2 = pinhead-2:PINHD-1X03: PIN HEADER
JP3 = pinhead-2:PINHD-1X02: PIN HEADER
L1 = generic-rcl:L
PCIE-NORTH PCIE-SOUTH = PCIe:PCIE-36-AXIOM
R1-R15 = generic-rcl:R
U1 = eeprom:BR24G04
U2 = gs122xx:GS12241
U3 U4 = gs122xx:GS12281
U5 = dsc11xx:DSC11XX: DUAL-BIT DUAL-SUPPLY BUS TRANSCEIVER
X1-X3 = hdbnc:HDBNC

## Net classes
0 default: width 0.152 mm, drill 0.203 mm, clearance 0.152 mm
1 LVDS: width 0.152 mm, drill 0.254 mm, clearance 0.152 mm
2 75Ohm: width 0.178 mm, drill 0.203 mm, clearance 0.254 mm
3 MGT: width 0.152 mm, drill 0.203 mm, clearance 0.356 mm